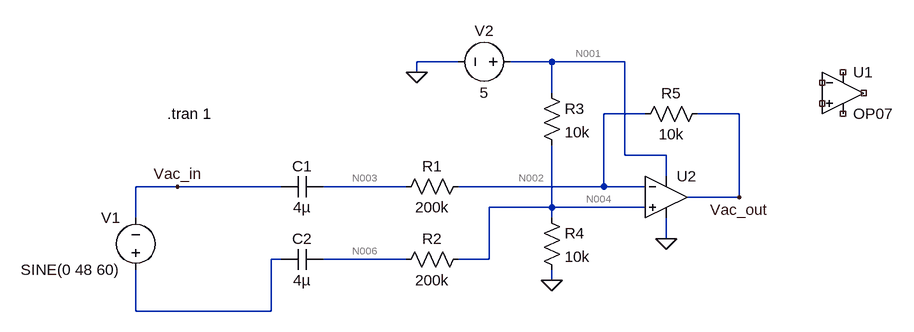
[diagram p0: schematic AC_Voltage_Sensing.asc]
AC_Voltage_Sensing.asc, the LTspice schematic file:
Version 4
SHEET 1 1268 680
WIRE 576 -80 512 -80
WIRE 720 -80 656 -80
WIRE 832 -80 720 -80
WIRE 512 -64 512 -80
WIRE 720 -32 720 -80
WIRE 864 0 800 0
WIRE 1008 0 944 0
WIRE 832 64 832 -80
WIRE 896 64 832 64
WIRE 896 96 896 64
WIRE 144 112 80 112
WIRE 304 112 144 112
WIRE 496 112 368 112
WIRE 800 112 800 0
WIRE 800 112 576 112
WIRE 864 112 800 112
WIRE 1008 128 1008 0
WIRE 1008 128 928 128
WIRE 720 144 720 48
WIRE 720 144 624 144
WIRE 864 144 720 144
WIRE 80 160 80 112
WIRE 720 160 720 144
WIRE 896 192 896 160
WIRE 304 224 288 224
WIRE 496 224 368 224
WIRE 624 224 624 144
WIRE 624 224 576 224
WIRE 720 256 720 240
WIRE 80 304 80 240
WIRE 288 304 288 224
WIRE 288 304 80 304
FLAG 896 192 0
FLAG 512 -64 0
FLAG 720 256 0
FLAG 144 112 Vac_in
FLAG 1008 128 Vac_out
SYMBOL voltage 80 256 R180
WINDOW 0 24 96 Left 2
WINDOW 3 24 16 Left 2
WINDOW 123 24 -12 Left 2
WINDOW 39 0 0 Left 0
SYMATTR InstName V1
SYMATTR Value SINE(0 48 60)
SYMBOL cap 368 96 R90
WINDOW 0 0 32 VBottom 2
WINDOW 3 32 32 VTop 2
SYMATTR InstName C1
SYMATTR Value 4µ
SYMBOL cap 368 208 R90
WINDOW 0 0 32 VBottom 2
WINDOW 3 32 32 VTop 2
SYMATTR InstName C2
SYMATTR Value 4µ
SYMBOL res 592 96 R90
WINDOW 0 0 56 VBottom 2
WINDOW 3 32 56 VTop 2
SYMATTR InstName R1
SYMATTR Value 200k
SYMBOL res 592 208 R90
WINDOW 0 0 56 VBottom 2
WINDOW 3 32 56 VTop 2
SYMATTR InstName R2
SYMATTR Value 200k
SYMBOL Opamps\\OP07 1168 -96 R0
SYMATTR InstName U1
SYMBOL res 704 -48 R0
SYMATTR InstName R3
SYMATTR Value 10k
SYMBOL voltage 672 -80 R90
WINDOW 0 -32 56 VBottom 2
WINDOW 3 32 56 VTop 2
WINDOW 123 0 0 Left 0
WINDOW 39 0 0 Left 0
SYMATTR InstName V2
SYMATTR Value 5
SYMBOL res 704 144 R0
SYMATTR InstName R4
SYMATTR Value 10k
SYMBOL res 960 -16 R90
WINDOW 0 0 56 VBottom 2
WINDOW 3 32 56 VTop 2
SYMATTR InstName R5
SYMATTR Value 10k
SYMBOL Opamps\\UniversalOpAmp 896 128 R0
SYMATTR InstName U2
TEXT 128 0 Left 2 !.tran 1

The netlist it stands for:
* AC_Voltage_Sensing.asc
V1 N005 Vac_in SINE(0 48 60)
C1 N003 Vac_in 4µ
C2 N006 N005 4µ
R1 N002 N003 200k
R2 N004 N006 200k
XU1 NC_01 NC_02 NC_03 NC_04 NC_05 LT1001  ; OP07, pins In+ In- V+ V- OUT
R3 N001 N004 10k
V2 N001 0 5
R4 N004 0 10k
R5 Vac_out N002 10k
XU2 N004 N002 N001 0 Vac_out level1 Avol=1Meg GBW=10Meg Vos=0 En=0 Enk=0 In=0 Ink=0 Rin=500Meg  ; pins In+ In- V+ V- OUT
.tran 1
.lib LTC.lib
.lib UniversalOpAmp1.lib
.backanno
.end

* Results of the author's LTspice run, read from the files saved beside the schematic
* Operating Point, zero values left out:
*   V(n003) = 2.5 V
*   V(n006) = 2.5 V
*   V(n002) = 2.5 V
*   V(n004) = 2.5 V
*   V(n001) = 5 V
*   V(vac_out) = 2.5 V
*   I(R4) = 250 µA
*   I(R3) = 250 µA
*   I(V2) = -250 µA
*   Ix(u1:3) = 1.18 pA
*   Ix(u2:3) = 5 nA
*   Ix(u2:4) = -5 nA
*   Ix(u2:5) = 931.3 pA
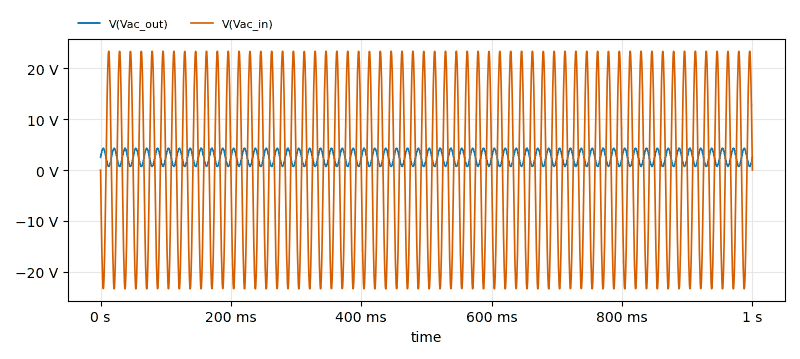
[diagram p1: Transient Analysis of AC_Voltage_Sensing.asc, plotted from the saved traces]
* Transient Analysis, 1 run:
*   V(Vac_out): min 699.1 mV, max 4.294 V, average 2.497 V, rms 2.796 V, last 2.504 V
*   V(Vac_in): min -23.4 V, max 23.4 V, average -1.045 mV, rms 16.63 V, last 1.425 mV